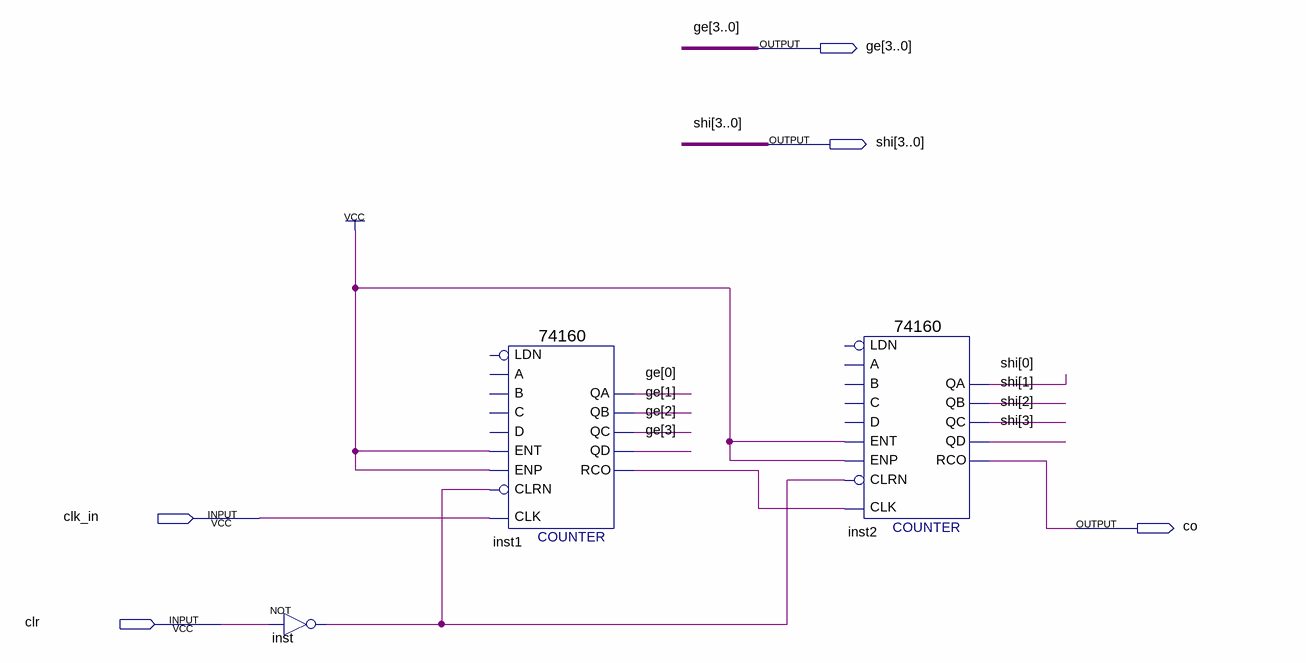
[diagram p0: schematic sheet]
// Quartus schematic cnt100.bdf as structural Verilog: 3 symbols, 5 pins
module cnt100 (
  input  clk_in,
  input  clr,
  output [3:0] ge,
  output [3:0] shi,
  output co
);

  wire inst1_rco, inst_out;

  not inst (inst_out, clr);
  \74160  inst1 (
    .CLK(clk_in), .ENT(1'b1), .ENP(1'b1), .CLRN(inst_out), .QD(ge[3]), .QA(ge[0]), .QB(ge[1]), .QC(ge[2]),
    .RCO(inst1_rco));  // open: A, B, C, D, LDN
  \74160  inst2 (
    .CLK(inst1_rco), .ENT(1'b1), .ENP(1'b1), .CLRN(inst_out), .QD(shi[3]), .QA(shi[0]), .QB(shi[1]),
    .QC(shi[2]), .RCO(co));  // open: A, B, C, D, LDN
endmodule
